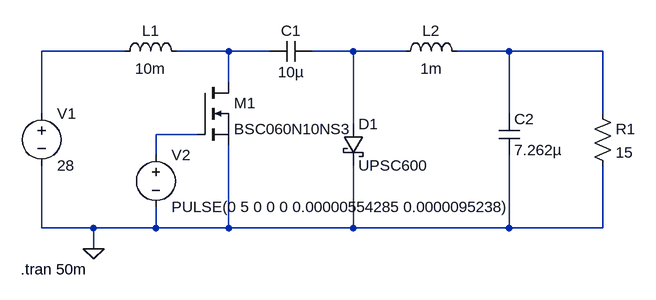
[diagram p0: schematic cuk_circuit.asc]
cuk_circuit.asc, the LTspice schematic file:
Version 4
SHEET 1 880 680
WIRE -272 64 -400 64
WIRE -112 64 -192 64
WIRE -48 64 -112 64
WIRE 80 64 16 64
WIRE 160 64 80 64
WIRE 320 64 240 64
WIRE 464 64 320 64
WIRE -112 112 -112 64
WIRE -400 160 -400 64
WIRE 320 160 320 64
WIRE 464 160 464 64
WIRE 80 176 80 64
WIRE -160 192 -224 192
WIRE -224 224 -224 192
WIRE -400 336 -400 240
WIRE -320 336 -400 336
WIRE -224 336 -224 304
WIRE -224 336 -320 336
WIRE -112 336 -112 208
WIRE -112 336 -224 336
WIRE 80 336 80 240
WIRE 80 336 -112 336
WIRE 320 336 320 224
WIRE 320 336 80 336
WIRE 464 336 464 240
WIRE 464 336 320 336
WIRE -320 368 -320 336
FLAG -320 368 0
SYMBOL voltage -400 144 R0
WINDOW 123 0 0 Left 0
WINDOW 39 0 0 Left 0
SYMATTR InstName V1
SYMATTR Value 28
SYMBOL ind -288 80 R270
WINDOW 0 32 56 VTop 2
WINDOW 3 5 56 VBottom 2
SYMATTR InstName L1
SYMATTR Value 10m
SYMBOL cap 304 160 R0
SYMATTR InstName C2
SYMATTR Value 7.262µ
SYMBOL res 448 144 R0
SYMATTR InstName R1
SYMATTR Value 15
SYMBOL voltage -224 208 R0
WINDOW 123 0 0 Left 0
WINDOW 39 0 0 Left 0
SYMATTR InstName V2
SYMATTR Value PULSE(0 5 0 0 0 0.00000554285 0.0000095238)
SYMBOL schottky 64 176 R0
SYMATTR InstName D1
SYMATTR Value UPSC600
SYMATTR Description Diode
SYMATTR Type diode
SYMBOL nmos -160 112 R0
SYMATTR InstName M1
SYMATTR Value BSC060N10NS3
SYMBOL cap 16 48 R90
WINDOW 0 0 32 VBottom 2
WINDOW 3 32 32 VTop 2
SYMATTR InstName C1
SYMATTR Value 10µ
SYMBOL ind 144 80 R270
WINDOW 0 32 56 VTop 2
WINDOW 3 5 56 VBottom 2
SYMATTR InstName L2
SYMATTR Value 1m
TEXT -432 400 Left 2 !.tran 50m

The netlist it stands for:
* cuk_circuit.asc
V1 N001 0 28
L1 N001 N002 10m
C2 N004 0 7.262µ
R1 N004 0 15
V2 N005 0 PULSE(0 5 0 0 0 0.00000554285 0.0000095238)
D1 N003 0 UPSC600
M1 N002 N005 0 0 BSC060N10NS3
C1 N003 N002 10µ
L2 N003 N004 1m
.model D D
.lib standard.dio
.model NMOS NMOS
.model PMOS PMOS
.lib standard.mos
.tran 50m
.backanno
.end